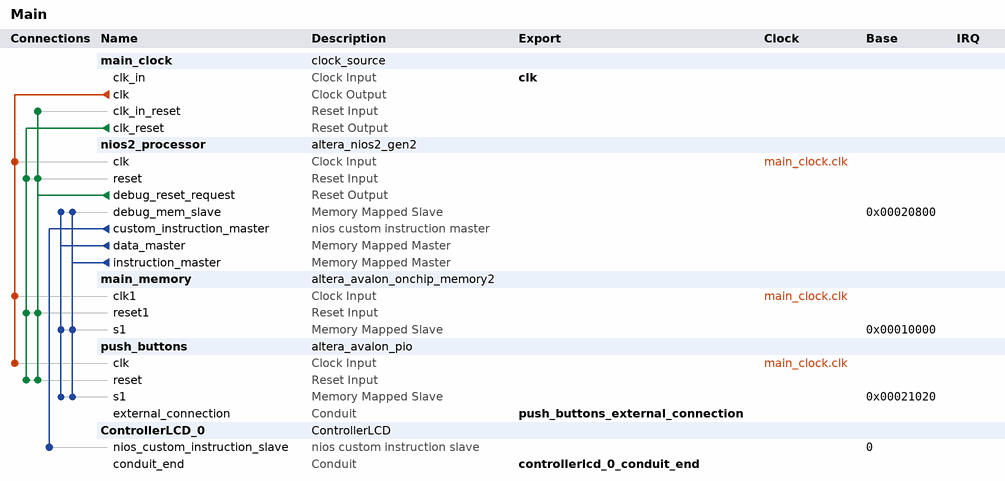
[diagram p0: system contents]
# Platform Designer (Qsys) system Main, Cyclone IV E EP4CE30F23C7
# Parameters at their usual value, and those the tool derives, are not listed.
package require -exact qsys 18.1
create_system Main
set_project_property DEVICE_FAMILY {Cyclone IV E}
set_project_property DEVICE EP4CE30F23C7

add_instance main_clock clock_source 18.1
set_instance_parameter_value main_clock clockFrequency 50000000

add_instance nios2_processor altera_nios2_gen2 18.1
set_instance_parameter_value nios2_processor dcache_size 2048
set_instance_parameter_value nios2_processor exceptionSlave main_memory.s1
set_instance_parameter_value nios2_processor icache_size 4096
set_instance_parameter_value nios2_processor impl Tiny
set_instance_parameter_value nios2_processor resetSlave main_memory.s1
set_instance_parameter_value nios2_processor setting_activateTrace true

add_instance main_memory altera_avalon_onchip_memory2 18.1
set_instance_parameter_value main_memory dataWidth 32
set_instance_parameter_value main_memory dualPort false
set_instance_parameter_value main_memory initMemContent true
set_instance_parameter_value main_memory initializationFileName onchip_mem.hex
set_instance_parameter_value main_memory memorySize 40096

add_instance push_buttons altera_avalon_pio 18.1
set_instance_parameter_value push_buttons direction Input
set_instance_parameter_value push_buttons simDoTestBenchWiring true
set_instance_parameter_value push_buttons width 4

add_instance ControllerLCD_0 ControllerLCD 1.0
set_instance_parameter_value ControllerLCD_0 LCD_BACKLIGHT 11
set_instance_parameter_value ControllerLCD_0 LCD_EN 10
set_instance_parameter_value ControllerLCD_0 LCD_RS 9
set_instance_parameter_value ControllerLCD_0 LCD_RW 8

# connections
add_connection main_clock.clk main_memory.clk1 clock
add_connection main_clock.clk nios2_processor.clk clock
add_connection main_clock.clk push_buttons.clk clock
add_connection main_clock.clk_reset main_memory.reset1 reset
add_connection main_clock.clk_reset nios2_processor.reset reset
add_connection main_clock.clk_reset push_buttons.reset reset
add_connection nios2_processor.debug_reset_request main_clock.clk_in_reset reset
add_connection nios2_processor.debug_reset_request main_memory.reset1 reset
add_connection nios2_processor.debug_reset_request nios2_processor.reset reset
add_connection nios2_processor.debug_reset_request push_buttons.reset reset
add_connection nios2_processor.data_master main_memory.s1 avalon
set_connection_parameter_value nios2_processor.data_master/main_memory.s1 baseAddress 0x00010000
add_connection nios2_processor.data_master nios2_processor.debug_mem_slave avalon
set_connection_parameter_value nios2_processor.data_master/nios2_processor.debug_mem_slave baseAddress 0x00020800
add_connection nios2_processor.data_master push_buttons.s1 avalon
set_connection_parameter_value nios2_processor.data_master/push_buttons.s1 baseAddress 0x00021020
add_connection nios2_processor.instruction_master main_memory.s1 avalon
set_connection_parameter_value nios2_processor.instruction_master/main_memory.s1 baseAddress 0x00010000
add_connection nios2_processor.instruction_master nios2_processor.debug_mem_slave avalon
set_connection_parameter_value nios2_processor.instruction_master/nios2_processor.debug_mem_slave baseAddress 0x00020800
add_connection nios2_processor.instruction_master push_buttons.s1 avalon
set_connection_parameter_value nios2_processor.instruction_master/push_buttons.s1 baseAddress 0x00021020
add_connection nios2_processor.custom_instruction_master ControllerLCD_0.nios_custom_instruction_slave nios_custom_instruction
set_connection_parameter_value nios2_processor.custom_instruction_master/ControllerLCD_0.nios_custom_instruction_slave CIName controllerlcd_0
set_connection_parameter_value nios2_processor.custom_instruction_master/ControllerLCD_0.nios_custom_instruction_slave baseAddress 0

# exported interfaces
add_interface clk clock sink
set_interface_property clk EXPORT_OF main_clock.clk_in
add_interface controllerlcd_0_conduit_end conduit end
set_interface_property controllerlcd_0_conduit_end EXPORT_OF ControllerLCD_0.conduit_end
add_interface push_buttons_external_connection conduit end
set_interface_property push_buttons_external_connection EXPORT_OF push_buttons.external_connection

set_interconnect_requirement {$system} qsys_mm.clockCrossingAdapter HANDSHAKE
set_interconnect_requirement {$system} qsys_mm.insertDefaultSlave false
set_interconnect_requirement {$system} qsys_mm.maxAdditionalLatency 1

save_system Main.qsys
